# Altium schematic sheet 5_Probe.SCHDOC
size 297 x 209 mm; SheetNumber: 17; SheetTotal: 18; DocumentName: 5_Probe.SCHDOC
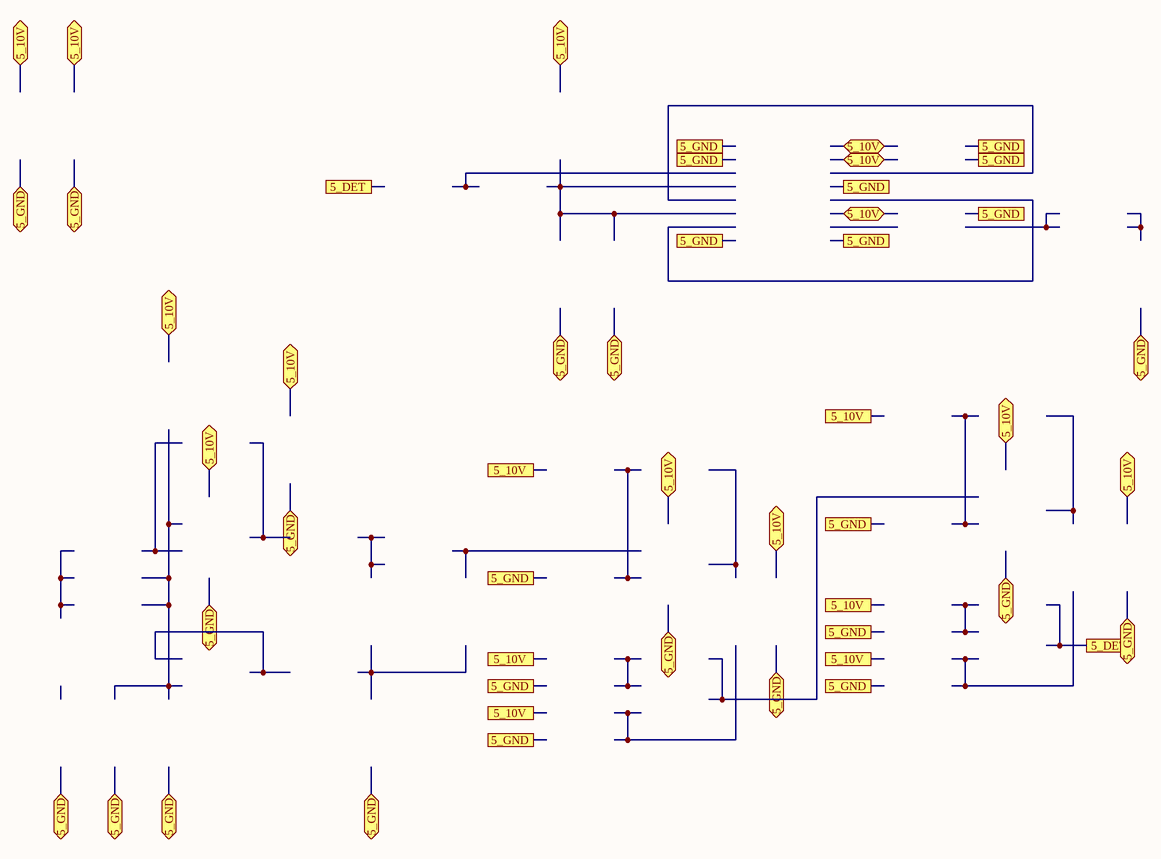
[diagram p0: 5_Probe.SCHDOC]

## Ports
5_10V, 5_10V (bidir), 5_DET, 5_GND

## Notes on the sheet
- A
- B
- C
- D
- 1
- 2
- 3
- Title
- 4
- Size
- A4
- Number
- Rev
- Date
- Filename
- Drawn by
- Sheet
- of